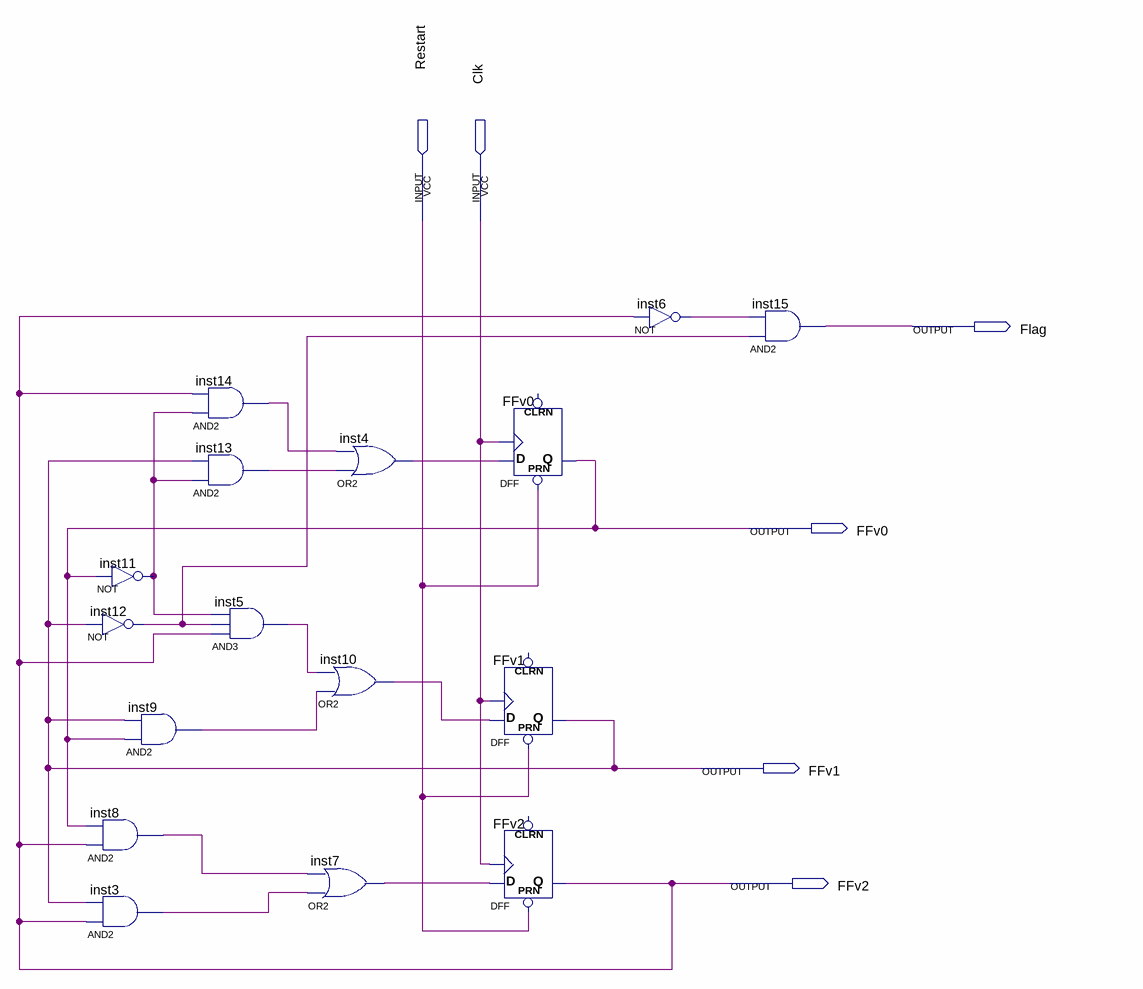
[diagram p0: schematic sheet]
// Quartus schematic PosicaoVerticalAlien.bdf as structural Verilog: 16 symbols, 6 pins
module PosicaoVerticalAlien (
  input  Restart,
  input  Clk,
  output Flag,
  output FFv0,
  output FFv1,
  output FFv2
);

  wire inst3_out, inst4_out, inst5_out, inst6_out, inst7_out, inst8_out, inst9_out, inst10_out, inst11_out,
       inst12_out, inst13_out, inst14_out;

  not inst11 (inst11_out, FFv0);
  not inst12 (inst12_out, FFv1);
  and inst9 (inst9_out, FFv0, FFv1);
  and inst8 (inst8_out, FFv2, FFv0);
  and inst3 (inst3_out, FFv2, FFv1);
  and inst14 (inst14_out, inst11_out, FFv2);
  and inst13 (inst13_out, inst11_out, FFv1);
  and inst5 (inst5_out, FFv2, inst12_out, inst11_out);
  or inst4 (inst4_out, inst13_out, inst14_out);
  or inst10 (inst10_out, inst9_out, inst5_out);
  or inst7 (inst7_out, inst3_out, inst8_out);
  DFF u_FFv0 (.CLK(Clk), .D(inst4_out), .PRN(Restart), .Q(FFv0));  // open: CLRN
  DFF u_FFv1 (.CLK(Clk), .D(inst10_out), .PRN(Restart), .Q(FFv1));  // open: CLRN
  DFF u_FFv2 (.CLK(Clk), .D(inst7_out), .PRN(Restart), .Q(FFv2));  // open: CLRN
  not inst6 (inst6_out, FFv2);
  and inst15 (Flag, inst12_out, inst6_out);
endmodule
